# EAGLE design wt41_breakout_board_v22 (EAGLE 6.5.0)
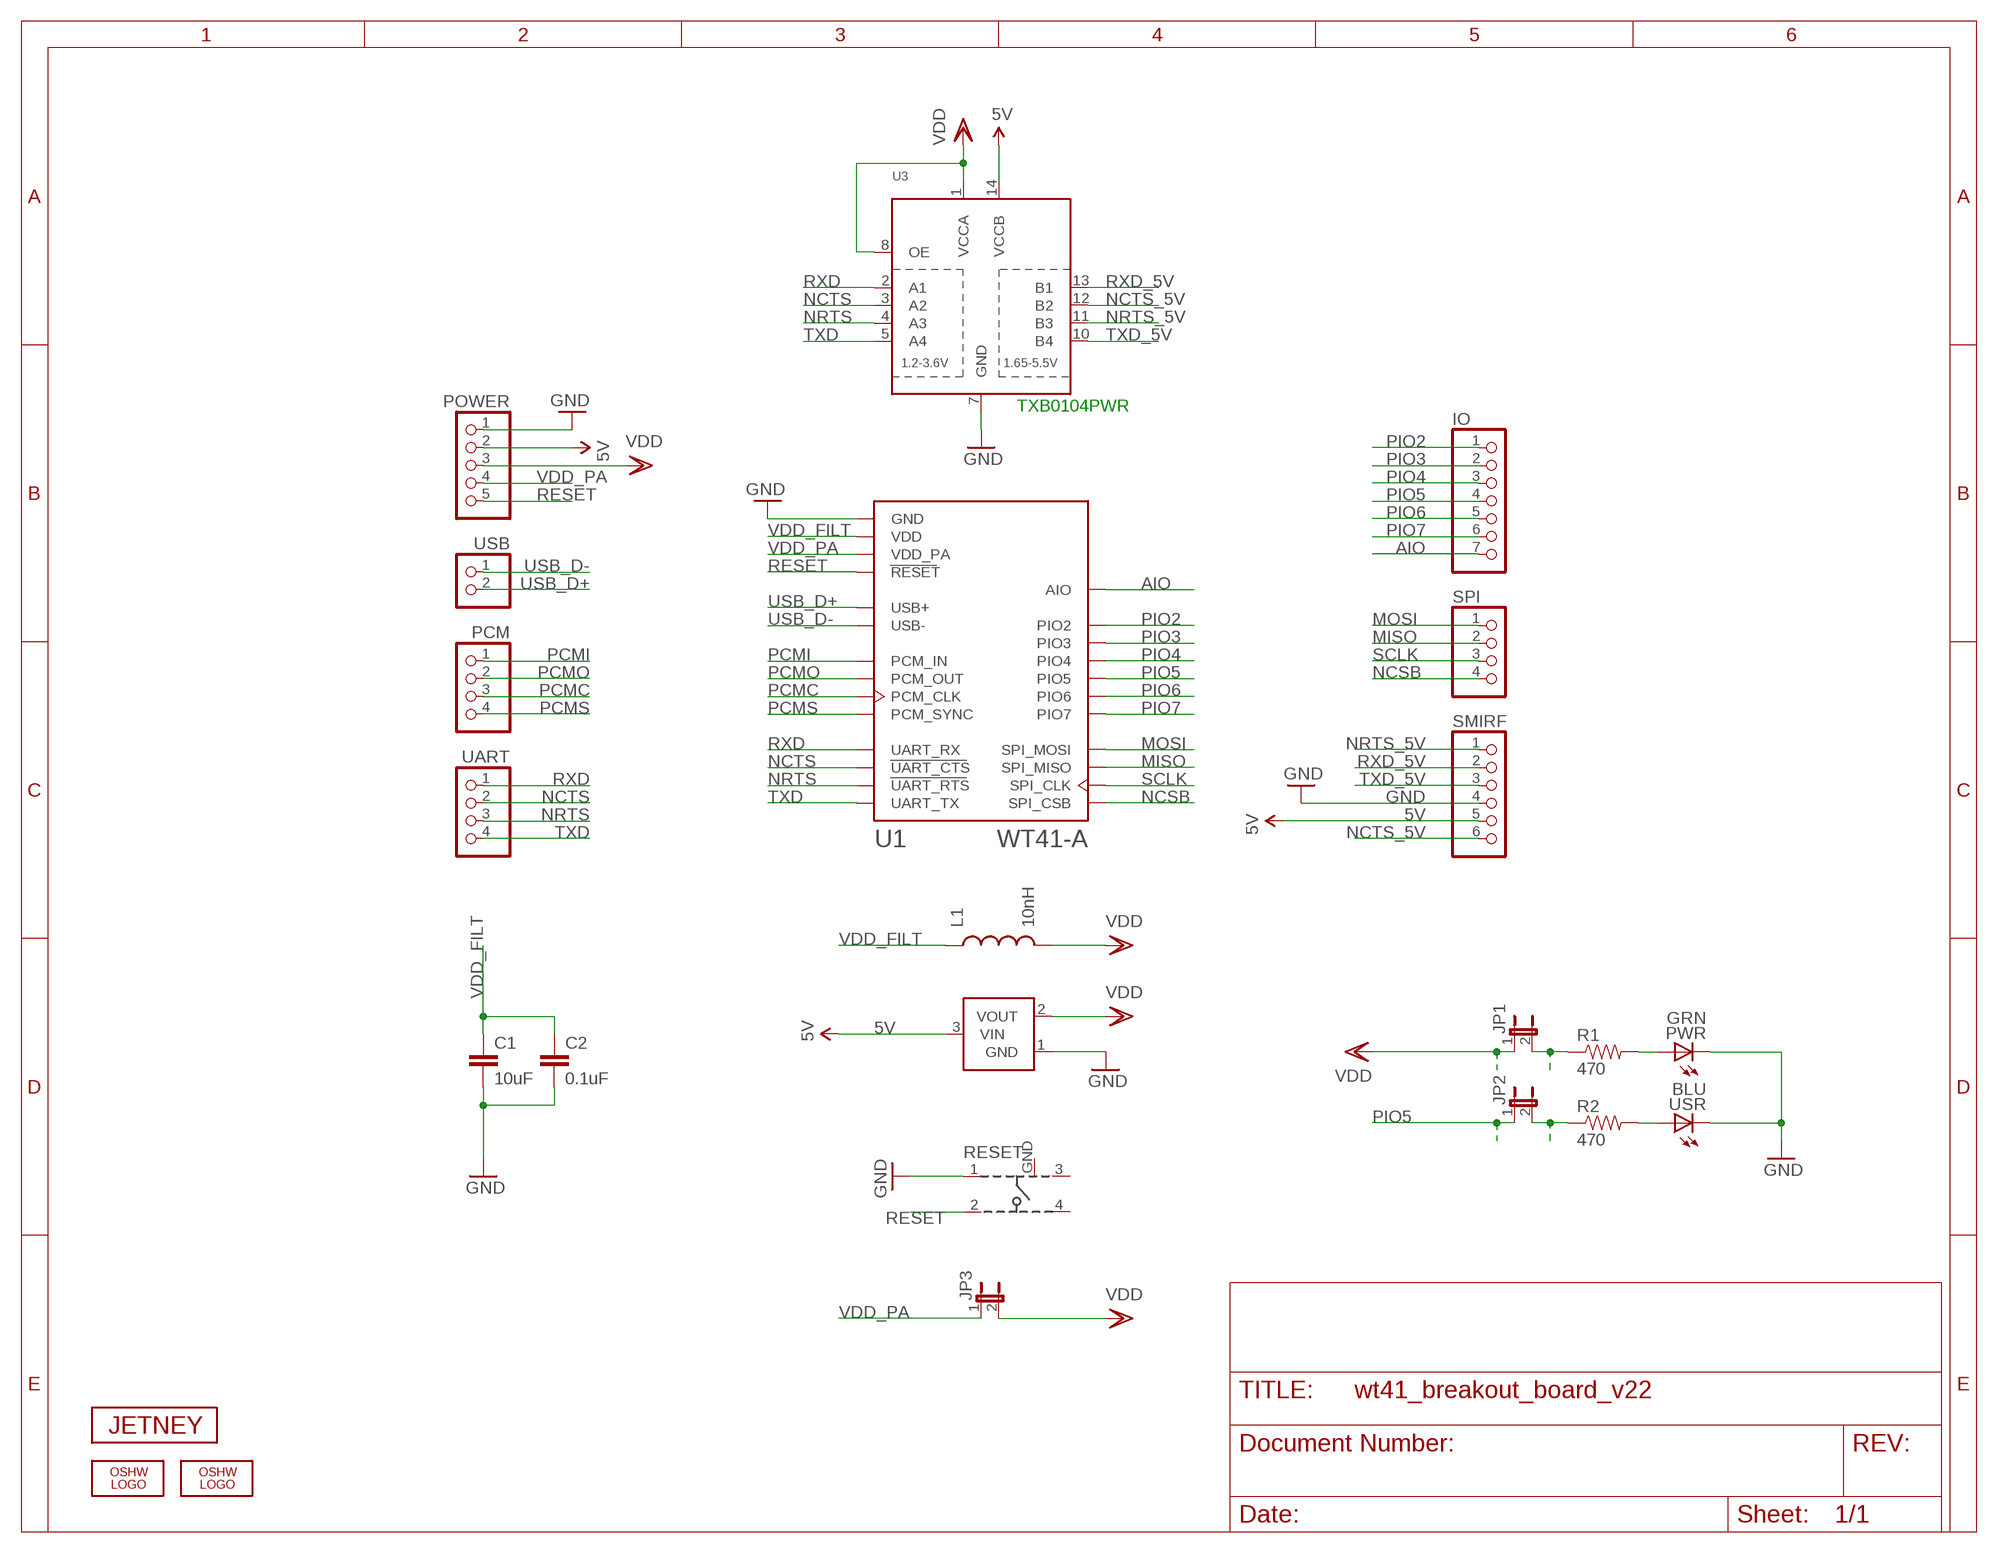
[diagram p0: schematic, sheet 1]

## Parts
C1  10uF  CAP0603-CAP  [0603-CAP]
C2  0.1uF  CAP0603-CAP  [0603-CAP]
IO  PINHD-1X7  [1X07]
JP1  JUMPER-2SMD-NC  [SJ_2S]
JP2  JUMPER-2SMD-NC  [SJ_2S]
JP3  JUMPER-2SMD-NC  [SJ_2S]
L1  10nH  INDUCTOR0603  [0603]
LOGO1  OSHW_LOGO_FILLX0070-NT  [OSHW_FILLX70_NOTEXT]
LOGO2  OSHW_LOGO_FILLX0070-NT  [OSHW_FILLX70_NOTEXT]
PCM  PINHD-1X4  [1X04]
POWER  PINHD-1X5  [1X05]
PWR  GRN  LEDCHIPLED_0805  [CHIPLED_0805]
R1  470  RESISTOR0603-RES  [0603-RES]
R2  470  RESISTOR0603-RES  [0603-RES]
RESET  101-IG  [101-IG]
SMIRF  PINHD-1X6  [1X06]
SPI  PINHD-1X4  [1X04]
U1  WT41-A  [WT41-A]
U2  MCP1700  [SOT23-3]
U3  TXB0104PWR  [TSSOP14]
U$2  JETNEY-LOGO-12  [JETNEY-LOGO-12]
UART  PINHD-1X4  [1X04]
USB  PINHD-1X2  [1X02]
USR  BLU  LEDCHIPLED_0805  [CHIPLED_0805]

## Nets
5V [power]: POWER.2 SMIRF.5 U2.3(VIN) U3.14(VCCB)
AIO: IO.7 U1.AIO
GND [power]: C1.2 C2.2 POWER.1 PWR.C RESET.1 SMIRF.4 U1.GND U1.GND@2(GND) U1.GND@3(GND) U1.GND@4(GND) U1.GND@5(GND) U1.GND@6(GND) U1.GND@7(GND) U1.GND@8(GND) U1.GND@9(GND) U1.GND@10(GND) U1.GND@11(GND) U1.GND@12(GND) U1.GND@13(GND) U1.GND@14(GND) U1.GND@15(GND) U1.GND@16(GND) U1.GND@17(GND) U1.GND@18(GND) U1.GND@19(GND) U1.GND@20(GND) U1.GND@21(GND) U1.GND@22(GND) U1.GND@23(GND) U1.GND@24(GND) U1.GND@25(GND) U1.GND@26(GND) U1.GND@27(GND) U1.GND@28(GND) U1.GND@29(GND) U1.GND@30(GND) U1.GND@31(GND) U2.1(GND) U3.7(GND) USR.C
MISO: SPI.2 U1.SPI_MISO
MOSI: SPI.1 U1.SPI_MOSI
N$1: PWR.A R1.2
N$3: R2.2 USR.A
N$4: JP2.2 R2.1
NCSB: SPI.4 U1.SPI_CSB
NCTS: U1.UART_CTS U3.3(A2) UART.2
NCTS_5V: SMIRF.6 U3.12(B2)
NRTS: U1.UART_RTS U3.4(A3) UART.3
NRTS_5V: SMIRF.1 U3.11(B3)
PCMC: PCM.3 U1.PCM_CLK
PCMI: PCM.1 U1.PCM_IN
PCMO: PCM.2 U1.PCM_OUT
PCMS: PCM.4 U1.PCM_SYNC
PIO2: IO.1 U1.PIO2
PIO3: IO.2 U1.PIO3
PIO4: IO.3 U1.PIO4
PIO5: IO.4 JP2.1 U1.PIO5
PIO6: IO.5 U1.PIO6
PIO7: IO.6 U1.PIO7
RESET: POWER.5 RESET.2 U1.RESET
RXD: U1.UART_RX U3.2(A1) UART.1
RXD_5V: SMIRF.2 U3.13(B1)
SCLK: SPI.3 U1.SPI_CLK
TXD: U1.UART_TX U3.5(A4) UART.4
TXD_5V: SMIRF.3 U3.10(B4)
USB_D+: U1.USB+ USB.2
USB_D-: U1.USB- USB.1
VDD [power]: JP1.1 JP3.2 L1.2 POWER.3 U2.2(VOUT) U3.1(VCCA) U3.8(OE)
VDD_FILT [power]: C1.1 C2.1 L1.1 U1.VDD
VDD_PA [power]: JP3.1 POWER.4 U1.VDD_PA
VDDJP1 [power]: JP1.2 R1.1
Unconnected: RESET.3 RESET.4

## Notes on the sheet
- TXB0104PWR

## Power pins joined to a net without a drawn wire
GND: RESET.GND

## Library data of the parts
C1 C2 = SparkFun:CAP: Capacitor Standard 0603 ceramic capacitor, and 0.1" leaded capacitor.
IO = sf-pinhead:PINHD-1X7: PIN HEADER
JP1-JP3 = SparkFun:JUMPER-2: Jumper Basic 0.1" spaced jumper. Use with breakaway headers.
L1 = SparkFun:INDUCTOR: Inductors Basic Inductor/Choke - 0603 and 1206. Footprints are not proven and vary greatly between part numbers.
LOGO1 LOGO2 = oshw-logo:OSHW_LOGO_FILL
PCM SPI UART = sf-pinhead:PINHD-1X4: PIN HEADER
POWER = sf-pinhead:PINHD-1X5: PIN HEADER
PWR USR = adafruit:LED: LED OSRAM: - CHIPLED LG R971, LG N971, LY N971, LG Q971, LY Q971, LO R971, LY R971 LH N974, LH R974 LS Q976, LO Q976, LY Q976 LO Q996 - Hyper CHIPLED LW Q18S LB Q993, LB Q99A, LB R99A - SideLED LS A670, LO A670, LY A670, LG A670, LP A670 LB A673, LV A673, LT A673, LW A673 LH A674 LY A675 LS A676, LA A676, LO A676, LY A676, LW A676 LS A679, LY A679, LG A679 - Hyper Micro SIDELED® LS Y876, LA Y876, LO Y876, LY Y876 LT Y87S - SmartLED LW L88C, LW L88S LB L89C, LB L89S, LG L890 LS L89K, LO L89K, LY L89K LS L896, LA L896, LO L896, LY L896 - TOPLED LS T670, LO T670, LY T670, LG T670, LP T670 LSG T670, LSP T670, LSY T670, LOP T670, LYG T670 LG T671, LOG T671, LSG T671 LB T673, LV T673, LT T673, LW T673 LH T674 LS T676, LA T676, LO T676, LY T676, LB T676, LH T676, LSB T676, LW T676 LB T67C, LV T67C, LT T67C, LS T67K, LO T67K, LY T67K, LW E67C LS E67B, LA E67B, LO E67B, LY E67B, LB E67C, LV E67C, LT E67C LW T67C LS T679, LY T679, LG T679 LS T770, LO T770, LY T770, LG T770, LP T770 LB T773, LV T773, LT T773, LW T773 LH T774 LS E675, LA E675, LY E675, LS T675 LS T776, LA T776, LO T776, LY T776, LB T776 LHGB T686 LT T68C, LB T68C - Hyper Mini TOPLED® LB M676 - Mini TOPLED Santana® LG M470 LS M47K, LO M47K, LY M47K Source: http://www.osram.convergy.de/
R1 R2 = SparkFun:RESISTOR: Resistor Basic schematic elements and footprints for 0603, 1206, and PTH resistors.
RESET = sf-keyglove:101-IG
SMIRF = sf-pinhead:PINHD-1X6: PIN HEADER
U1 = sf-bluegiga:WT41: Bluegiga WT41 long-range Bluetooth module - Bluetooth 2.1 + EDR (+20 dBm, 1000m). WT41-A variant has an on-module ceramic chip antenna, WT41-E variant has a U.Fl connector. WT41-A variant should be mounted over a solid ground plane. Antenna edge of the module should be flush up agains the edge of the PCB. See datasheet for variant layout details. The WT41 is a fully integrated Bluetooth 2.1 + EDR, class 1 module combining antenna, Bluetooth radio, and an on-board iWRAP Bluetooth stack. The WT41 provides a superior 110dB link budget and more than 1000-meter line-of-sight connectivity for Bluetooth applications where extreme radio performance or reliability is required. It also constitutes an ideal solution for developers that want to quickly integrate extremely high performing Bluetooth wireless technology into their design without investing several months in Bluetooth radio and stack development. The WT41 uses Bluegiga's iWRAP Bluetooth stack, which is an embedded Bluetooth stack implementing 13 different Bluetooth profiles and Apple iAP connectivity. By using WT41 combined with iWRAP Bluetooth stack and Bluegiga's excellent technical support, designers ensure quick time-to-market, and low development costs and risks. http://www.bluegiga.com/en-US/products/bluetooth-classic-modules/wt41-long-range-bluetooth--module https://github.com/jrowberg/sf-oshw Last updated 2014-01-04 by Jeff Rowberg <jeff@rowberg.net>; ANTENNA: On-module ceramic chip antenna
U2 = nonolith:MCP1700: Voltage regulator
U3 = SparkFun-DigitalIC:TXB0104PWR: 4-Bit Bi-Directional Level Shifter 1.2V-3.6V (VCCA) to 1.65V-5.5V (VCCB) bi-directional level shifter with auto direction sensing. Max data rate - VCCA 1.8V: 20Mbps (50ns), VCCA 3.3V: 100Mbps (10ns) Digikey: 296-21929-1-ND (TSSOP) IC-11329
U$2 = sf-keyglove:JETNEY-LOGO
USB = sf-pinhead:PINHD-1X2: PIN HEADER

## Net classes
0 default: width 0.152 mm, drill 0.33 mm, clearance 0.152 mm
1 power: width 0.254 mm, drill 0.33 mm, clearance 0.152 mm

## Board
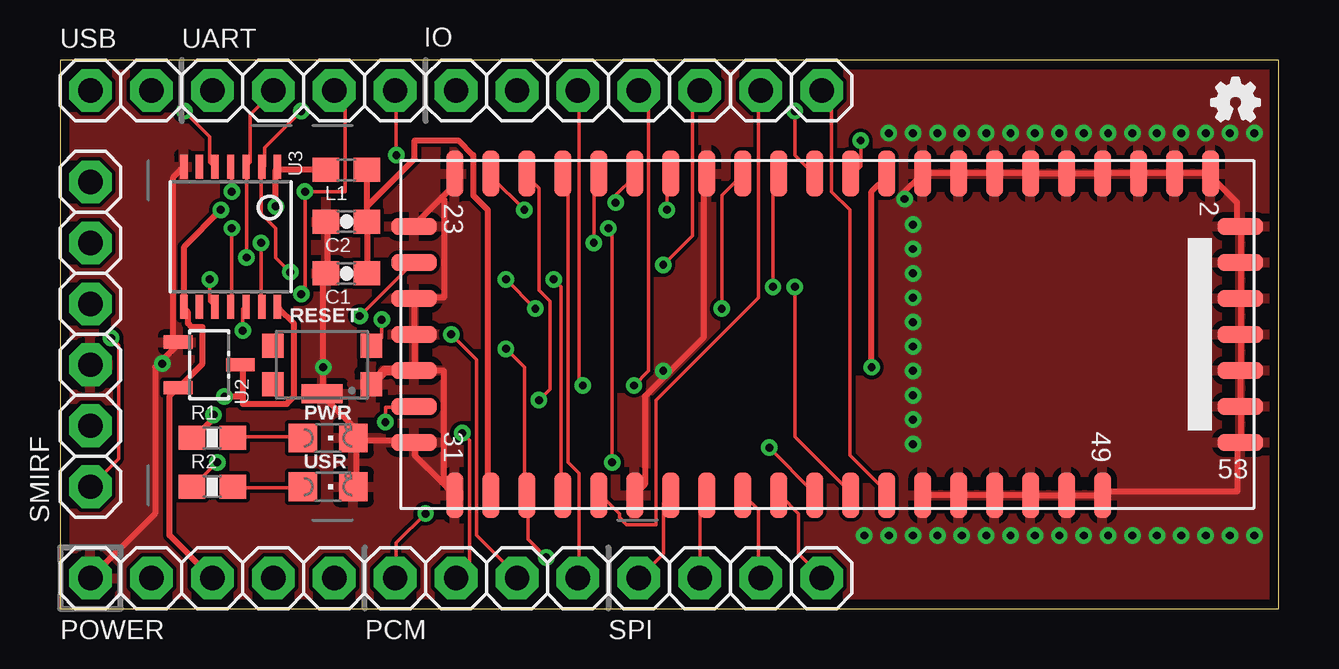
[diagram p1: board, top side]
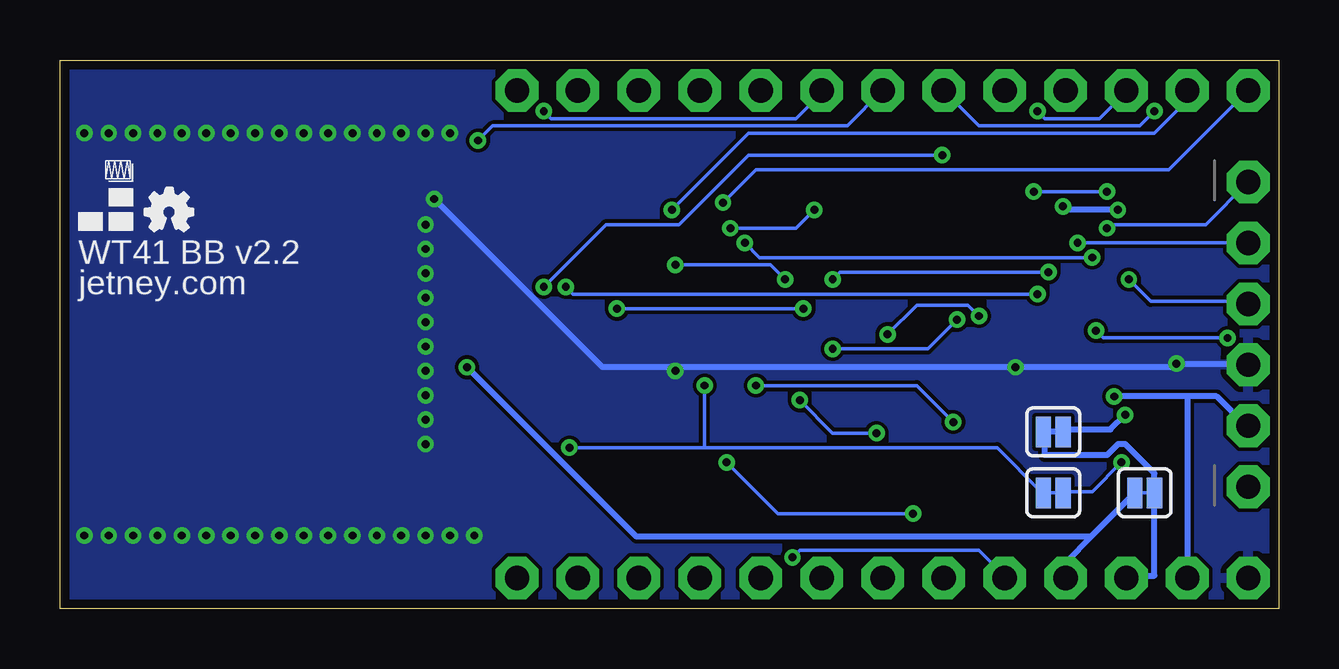
[diagram p2: board, bottom side, seen from below]

Size 50.8 x 22.86 mm. Coordinates in mm from the lower left corner, seen from the top.
Outline: 0,0 50.8,0 50.8,22.86 0,22.86 0,0
Copper layers (1*16): Top 0.0356mm / dielectric 1.5011mm / Bottom 0.0356mm
Design rules "LaenPCBOrder *": minimum track width 6mil, minimum drill 13mil, track to track 6mil, track to pad 6mil, pad to pad 6mil, via to via 6mil, smd to smd 6mil, copper to edge 15mil, drill to drill 6mil, minimum pad ring 7mil, minimum via ring 7mil, stop-mask expansion 4mil, vias tented up to drill 13mil, thermal gap 10mil
vRestrict: area 0,19.3 to 33,20.3; area 2.5,2.5 to 33,3.6; area 2.5,3.8 to 3.8,19.1; area 10.2,5.8 to 11.7,6.3; area 10.2,7.9 to 11.7,8.4

### Footprints (pad centres in the part's own frame; a part is rotated, then mirrored left to right if it is on the bottom)
0603-CAP = smd 1.1 x 1: 1 -0.85,0; 2 0.85,0
1X07 = drill 1.016 pad 1.778 octagon: 1 -7.62,0; 2 -5.08,0; 3 -2.54,0; 4 0,0; 5 2.54,0; 6 5.08,0; 7 7.62,0
SJ_2S = smd 0.635 x 1.27: 1 -0.412,0; 2 0.412,0
0603 = smd 1.1 x 1: 1 -0.85,0; 2 0.85,0
1X04 = drill 1.016 pad 1.778 octagon: 1 -3.81,0; 2 -1.27,0; 3 1.27,0; 4 3.81,0
1X05 = drill 1.016 pad 1.778 octagon: 1 -5.08,0; 2 -2.54,0; 3 0,0; 4 2.54,0; 5 5.08,0
CHIPLED_0805 = smd 1.2 x 1.2: A 0,-1.05; C 0,1.05
0603-RES = smd 1.1 x 1: 1 -0.85,0; 2 0.85,0
101-IG = smd 0.9 x 1: 1 -2.05,0.8; 2 -2.05,-0.8; 3 2.05,0.8; 4 2.05,-0.8 | smd 1.7 x 0.8: GND 0,1.2
1X06 = drill 1.016 pad 1.778 octagon: 1 -6.35,0; 2 -3.81,0; 3 -1.27,0; 4 1.27,0; 5 3.81,0; 6 6.35,0
WT41-A = smd 1.9 x 0.7: AIO 6.7,2.45; GND -6.7,15.95; GND@2 -6.7,14.45; GND@3 -6.7,12.95; GND@4 -6.7,11.45; GND@5 -6.7,9.95; GND@6 -6.7,8.45; GND@7 -6.7,6.95; GND@8 -6.7,5.45; GND@9 -6.7,3.95; GND@10 -6.7,-5.05; GND@11 -6.7,-15.55; GND@17 6.7,-15.55; GND@18 6.7,-8.05; GND@19 6.7,3.95; GND@20 6.7,5.45; GND@21 6.7,6.95; GND@22 6.7,8.45; GND@23 6.7,9.95; GND@24 6.7,11.45; PCM_CLK -6.7,-12.55; PCM_IN -6.7,-11.05; PCM_SYNC -6.7,-14.05; PIO2 -6.7,0.95; PIO3 -6.7,-0.55; PIO5 6.7,-0.55; PIO6 6.7,-11.05; PIO7 6.7,-9.55; RESET 6.7,-12.55; SPI_CLK 6.7,-5.05; SPI_CSB 6.7,-6.55; SPI_MISO 6.7,-3.55; SPI_MOSI 6.7,-2.05; UART_CTS -6.7,-9.55; UART_RTS -6.7,-2.05; UART_RX -6.7,-3.55; UART_TX 6.7,0.95; USB+ -6.7,-6.55; USB- -6.7,-8.05; VDD 6.7,-14.05; VDD_PA -6.7,2.45 | smd 0.7 x 1.9: GND@12 -4.5,-17.25; GND@13 -1.5,-17.25; GND@14 0,-17.25; GND@15 1.5,-17.25; GND@16 4.5,-17.25; GND@25 4.5,17.2; GND@26 3,17.2; GND@27 1.5,17.2; GND@28 0,17.2; GND@29 -1.5,17.2; GND@30 -3,17.2; GND@31 -4.5,17.2; PCM_OUT -3,-17.25; PIO4 3,-17.25
SOT23-3 = smd 0.55 x 1.2: 1 0.95,1.3; 2 -0.95,1.3; 3 0,-1.3
TSSOP14 = smd 0.305 x 0.991: 1 -1.95,-2.918; 2 -1.3,-2.918; 3 -0.65,-2.918; 4 0,-2.918; 5 0.65,-2.918; 6 1.3,-2.918; 7 1.95,-2.918; 8 1.95,2.918; 9 1.3,2.918; 10 0.65,2.918; 11 0,2.918; 12 -0.65,2.918; 13 -1.3,2.918; 14 -1.95,2.918
1X02 = drill 1.016 pad 1.778 octagon: 1 -1.27,0; 2 1.27,0

### Placement (x,y rotation side)
C1  11.94,13.97 180 top
C2  11.94,16.13 180 top
IO  24.13,21.59 0 top
JP1  9.4,7.37 0 bottom
JP2  9.4,4.83 0 bottom
JP3  5.59,4.83 0 bottom
L1  11.94,18.29 180 top
LOGO1  48.01,20.32 0 top
LOGO2  47.24,15.75 0 bottom
PCM  17.78,1.27 180 top
POWER  6.35,1.27 0 top
PWR  11.18,7.11 270 top
R1  6.35,7.11 0 top
R2  6.35,5.08 0 top
RESET  10.92,10.16 180 top
SMIRF  1.27,11.43 270 top
SPI  27.94,1.27 180 top
U1  32,11.43 270 top
U2  6.22,10.16 90 top
U3  7.11,15.49 180 top
U$2  50.04,15.75 0 bottom
UART  10.16,21.59 0 top
USB  2.54,21.59 0 top
USR  11.18,5.08 270 top

### Tracks (layer width: path | path; a pad name or v marks a point on that pad's centre or on a via)
5V  (via drill 0.33)
  Top 0.254: 7.62,8.84 7.62,10.06 U2.3 | 7.62,8.84 7.62,8.53 9.45,8.53 9.75,8.84 9.75,11.89 9.14,12.5 U3.14 | v6.86,8.84 7.62,8.84
  Bottom 0.254: 3.81,8.84 2.59,8.84 1.37,7.62 SMIRF.5 | 3.81,8.84 v6.86,8.84 | 3.81,8.84 POWER.2
AIO
  Top 0.152: IO.7 32.16,21.18 32.16,17.37 32.92,16.61 32.92,6.4 34.44,4.88 U1.AIO
GND  (via drill 0.33)
  Top 0.254: U1.GND 47.85,18.14 46.48,18.14 U1.GND@2 46.33,18.14 U1.GND@3 44.81,18.14 43.59,18.14 U1.GND@4 43.43,18.14 42.06,18.14 U1.GND@5 41.91,18.14 40.54,18.14 U1.GND@6 40.39,18.14 39.01,18.14 U1.GND@7 38.86,18.14 37.49,18.14 U1.GND@8 37.34,18.14 35.97,18.14 U1.GND@9 35.81,17.98 35.2,17.37 v35.2,17.07 | 48.01,18.14 U1.GND | U1.GND@19 35.97,4.72 37.34,4.72 U1.GND@20 37.49,4.72 38.86,4.72 U1.GND@21 39.01,4.72 40.39,4.72 U1.GND@22 40.54,4.72 41.91,4.72 U1.GND@23 42.06,4.72 43.43,4.72 U1.GND@24 43.59,4.88 49.07,4.88 49.07,6.86 U1.GND@25 49.23,7.01 49.23,8.38 U1.GND@26 49.23,8.53 49.23,9.91 U1.GND@27 49.23,10.06 49.23,11.43 | 49.23,11.43 49.23,12.8 U1.GND@29 49.23,12.95 49.23,14.33 U1.GND@30 49.23,14.48 49.23,15.85 U1.GND@31 | 49.23,16 U1.GND@31 | 49.23,11.43 U1.GND@28 | U1.GND 48.01,17.98 49.07,16.92 49.07,16 U1.GND@31 | 14.78,11.43 14.78,10.06 U1.GND@15 14.78,9.91 16,9.91 16,5.33 15.93,5.26 | 14.78,11.43 14.78,12.8 U1.GND@13 14.78,12.95 16,12.95 16,17.07 15.93,17.14 | 14.78,11.43 U1.GND@14 | 15.93,17.14 16.31,17.53 16.31,17.98 U1.GND@11 | 15.93,17.14 14.78,16 U1.GND@12 | U1.GND@17 16.31,4.88 15.93,5.26 | 15.93,5.26 14.78,6.4 14.78,6.86 U1.GND@16 | 14.78,7.01 U1.GND@16 | C2.2 11.12,16 11.12,14.02 C1.2 10.97,13.87 v10.97,10.06 10.97,8.99 RESET.GND 10.97,8.84 12.19,7.62 12.19,7.16 PWR.C 12.34,7.01 | 12.34,7.01 12.34,5.18 USR.C | 12.34,7.01 14.63,7.01 U1.GND@16 | 23.93,4.72 U1.GND@18 24.08,4.88 24.38,5.18 24.38,8.84 25.38,9.83 | 25.38,9.83 26.82,11.28 26.82,17.98 U1.GND@10 26.98,18.14 | U3.7 5.03,18.29 4.72,17.98 4.72,11.28 4.88,11.12 U2.1 | 5.03,11.12 U2.1
  Top 0.254: POWER.1 3.96,3.96 3.96,10.06 4.19,10.29 | 4.19,10.29 4.88,10.97 U2.1 | v4.27,10.21 4.19,10.29 | v25.15,9.91 25.3,9.91 25.38,9.83
  Top 0.406: RESET.1 13.54,9.93 U1.GND@15
  Bottom 0.254: SMIRF.4 1.37,10.21 v4.27,10.21 4.42,10.06 v10.97,10.06 24.99,10.06 v25.15,9.91 25.15,10.06 28.19,10.06 v35.2,17.07
  other vias: 49.78,3.05 48.77,3.05 47.75,3.05 46.74,3.05 45.72,3.05 44.7,3.05 43.69,3.05 42.67,3.05 41.66,3.05 40.64,3.05 39.62,3.05 38.61,3.05 37.59,3.05 36.58,3.05 35.56,3.05 34.54,3.05 33.53,3.05 49.78,19.81 48.77,19.81 47.75,19.81 46.74,19.81 45.72,19.81 44.7,19.81 43.69,19.81 42.67,19.81 41.66,19.81 40.64,19.81 39.62,19.81 38.61,19.81 37.59,19.81 36.58,19.81 35.56,19.81 34.54,19.81 35.56,16 35.56,14.99 35.56,13.97 35.56,12.95 35.56,11.94 35.56,10.92 35.56,9.91 35.56,8.89 35.56,7.87 35.56,6.86
  pour Top: 0,22.86 50.8,22.86 50.8,0 0,0
  pour Bottom: 0,22.86 50.8,22.86 50.8,0 0,0
MISO
  Top 0.152: U1.SPI_MISO 28.5,4.72 29.11,4.12 29.11,1.37 SPI.2
MOSI
  Top 0.152: U1.SPI_MOSI 30.02,4.72 30.79,3.96 30.79,2.29 31.7,1.37 SPI.1
N$1
  Top 0.152: R1.2 7.32,7.16 10.06,7.16 PWR.A
N$2
  Bottom 0.152: 5.33,4.83 5.84,4.83
N$3
  Top 0.152: R2.2 7.32,5.03 10.06,5.03 USR.A
N$4  (via drill 0.33)
  Top 0.152: v6.55,6.1 5.64,5.18 R2.1
  Bottom 0.152: v6.55,6.1 7.77,4.88 8.84,4.88 JP2.2
N$5
  Bottom 0.152: 9.14,4.83 9.65,4.83
N$6
  Bottom 0.254: 9.14,7.37 9.65,7.37
NCSB
  Top 0.152: SPI.4 25.15,2.29 25.15,4.42 U1.SPI_CSB
NCTS  (via drill 0.33)
  Top 0.152: UART.2 8.84,21.49 7.92,20.57 7.92,18.59 7.77,18.44 U3.3 7.77,18.29 v7.77,14.63 | v22.25,15.24 22.25,17.83 22.4,17.98 U1.UART_CTS
  Bottom 0.152: v22.25,15.24 21.64,14.63 v7.77,14.63
NCTS_5V  (via drill 0.33)
  Top 0.152: v7.62,11.58 7.62,12.5 U3.12 | v2.13,11.28 2.44,10.97 2.44,6.25 SMIRF.6
  Bottom 0.152: v7.62,11.58 7.32,11.28 v2.13,11.28
NRTS  (via drill 0.33)
  Top 0.152: v7.16,17.37 7.16,18.29 U3.4 | UART.3 11.43,21.49 11.89,21.03 11.89,17.37 v10.21,17.37 10.21,13.26 v10.06,13.11 | v29.72,13.41 29.72,17.83 29.87,17.98 U1.UART_RTS
  Bottom 0.152: v10.21,17.37 v7.16,17.37 | v29.72,13.41 29.41,13.11 v10.06,13.11
NRTS_5V  (via drill 0.33)
  Top 0.152: v7.16,15.85 7.16,12.65 U3.11
  Bottom 0.152: v7.16,15.85 7.01,16 3.05,16 SMIRF.1
PCMC  (via drill 0.33)
  Top 0.152: v19.96,8.69 20.42,9.14 20.42,12.8 19.96,13.26 19.96,17.53 19.51,17.98 U1.PCM_CLK | v16.76,7.32 17.07,7.01 17.07,1.83 PCM.3
  Bottom 0.152: v19.96,8.69 18.59,7.32 v16.76,7.32
PCMI
  Top 0.152: U1.PCM_IN 21.03,17.98 21.18,17.83 21.18,6.1 21.64,5.64 21.64,1.37 PCM.1
PCMO  (via drill 0.33)
  Top 0.152: v12.5,12.19 14.63,14.33 U1.PCM_OUT | v16.31,11.43 17.37,10.36 17.37,3.05 19.05,1.37 PCM.2
  Bottom 0.152: v12.5,12.19 12.95,12.65 15.09,12.65 v16.31,11.43
PCMS  (via drill 0.33)
  Top 0.152: v19.36,16.61 17.98,17.98 U1.PCM_SYNC | v22.86,15.85 23.01,15.7 v23.01,6.1 | v15.24,3.96 14.02,2.74 14.02,1.37 PCM.4
  Bottom 0.152: v19.36,16.61 20.12,15.85 v22.86,15.85 | v23.01,6.1 20.88,3.96 v15.24,3.96
PIO2  (via drill 0.33)
  Top 0.152: v33.38,19.51 33.38,18.44 33.07,18.14 U1.PIO2
  Bottom 0.152: v33.38,19.51 32.77,20.12 17.98,20.12 IO.1
PIO3  (via drill 0.33)
  Top 0.152: v30.63,20.73 30.63,18.9 31.39,18.14 U1.PIO3
  Bottom 0.152: v30.63,20.73 30.33,20.42 20.12,20.42 19.05,21.49 IO.2
PIO4  (via drill 0.33)
  Top 0.152: v13.56,7.77 13.56,8.38 14.63,8.38 U1.PIO4 | v21.79,9.3 21.64,9.45 21.64,21.49 IO.3
  Bottom 0.152: v13.56,7.77 15.09,9.3 v21.79,9.3
PIO5  (via drill 0.33)
  Top 0.152: v29.57,6.71 31.39,4.88 U1.PIO5 | IO.4 24.54,21.18 24.54,9.91 v23.93,9.3
  Bottom 0.152: v29.57,6.71 23.93,6.71 | 23.93,6.71 11.73,6.71 9.91,4.88 JP2.1 | 23.93,6.71 v23.93,9.3
PIO6  (via drill 0.33)
  Top 0.152: v20.57,13.72 20.88,13.41 20.88,4.88 U1.PIO6 | v25.15,14.33 26.36,15.54 26.36,21.18 26.67,21.49 IO.5
  Bottom 0.152: v20.57,13.72 21.18,14.33 v25.15,14.33
PIO7
  Top 0.152: U1.PIO7 22.55,4.72 23.32,3.96 23.32,3.81 23.62,3.5 24.84,3.5 24.84,8.69 29.11,12.95 29.11,21.49 IO.6
RESET  (via drill 0.33)
  Top 0.152: v13.41,12.04 13.41,11.28 13.11,10.97 RESET.2 | v18.59,10.82 19.36,10.06 19.36,4.88 U1.RESET 19.51,4.72 19.51,2.9 v20.27,2.13
  Bottom 0.152: v13.41,12.04 14.63,10.82 v18.59,10.82 | v20.27,2.13 19.96,2.44 12.5,2.44 11.43,1.37 POWER.5
RXD  (via drill 0.33)
  Top 0.152: v10.06,20.73 8.53,19.2 8.53,18.44 U3.2 8.38,18.29 8.38,16.46 8.99,15.85 8.99,14.63 v9.6,14.02 | v27.58,12.5 27.58,17.22 28.35,17.98 U1.UART_RX | v18.59,13.72 v19.81,12.5
  Bottom 0.152: v10.06,20.73 9.75,20.42 7.47,20.42 6.4,21.49 UART.1 | v19.81,12.5 v27.58,12.5 | v18.59,13.72 18.29,14.02 v9.6,14.02
RXD_5V  (via drill 0.33)
  Top 0.152: v8.38,15.24 8.38,12.65 U3.13
  Bottom 0.152: SMIRF.2 v8.38,15.24
SCLK
  Top 0.152: SPI.3 26.67,4.57 26.82,4.72 U1.SPI_CLK
TXD  (via drill 0.33)
  Top 0.152: v5.18,20.73 6.25,19.66 6.25,18.59 6.4,18.44 U3.5 | v30.63,13.41 30.63,7.16 32.92,4.88 U1.UART_TX | v14.02,18.9 14.02,21.49 UART.4
  Bottom 0.152: v5.18,20.73 5.79,20.12 12.5,20.12 UART.4 | v30.63,13.41 28.04,16 24.99,16 22.1,18.9 v14.02,18.9
TXD_5V  (via drill 0.33)
  Top 0.152: v6.25,13.72 6.25,12.8 6.4,12.65 U3.10
  Bottom 0.152: v6.25,13.72 5.33,12.8 1.37,12.8 SMIRF.3
USB_D+  (via drill 0.33)
  Top 0.152: v25.3,16.61 25.3,17.83 25.45,17.98 U1.USB+
  Bottom 0.152: v25.3,16.61 22.1,19.81 5.18,19.81 3.81,21.18 USB.2
USB_D-  (via drill 0.33)
  Top 0.152: v23.16,16.92 23.16,17.22 23.93,17.98 U1.USB-
  Bottom 0.152: v23.16,16.92 21.79,18.29 4.57,18.29 USB.1
VDD  (via drill 0.33)
  Top 0.254: L1.2 9.14,18.29 U3.1 8.99,18.29 v8.99,16.76 | v6.71,16.61 5.18,15.09 5.18,12.65 U3.8 5.18,12.5 5.33,12.34 5.33,11.89 5.49,11.73 5.94,11.73 5.94,10.21 5.03,9.3 U2.2 4.88,9.14 4.57,8.84 4.57,3.05 POWER.3
  Bottom 0.254: v8.99,16.76 8.84,16.61 v6.71,16.61 | 9.91,7.47 JP1.1 9.75,7.32 9.75,6.4 7.16,6.4 6.71,6.86 6.4,6.86 5.18,5.64 5.18,4.88 JP3.2 5.18,4.72 5.18,1.37 6.25,1.37 POWER.3
VDD_FILT
  Top 0.254: C1.1 12.8,14.02 12.8,16 C2.1 12.8,16.15 12.8,16.76 | 12.8,16.76 12.8,18.29 L1.1 | 12.8,16.76 14.78,18.75 14.78,19.51 16.61,19.51 17.22,18.9 17.22,17.22 17.83,16.61 17.83,4.88 U1.VDD
VDD_PA  (via drill 0.33)
  Top 0.254: U1.VDD_PA 34.44,17.98 33.83,17.37 v33.83,10.06
  Bottom 0.254: 7.82,3 8.84,1.98 8.84,1.37 POWER.4 | 7.82,3 6.1,4.72 JP3.1 | v33.83,10.06 26.77,3 7.82,3
VDDJP1  (via drill 0.33)
  Top 0.254: v6.4,8.08 6.4,7.92 5.64,7.16 R1.1
  Bottom 0.254: v6.4,8.08 7.01,7.47 8.84,7.47 JP1.2

### Text on the board
bPlace: WT41 BB v2.2 | jetney.com
tDocu: D- D+ | RTS RXD TXD GND VCC CTS | RXD CTS RTS TXD | P2 P3 P4 P5 P6 P7 | AIO | Bluegiga / WT41-A | GND 3V3 VPA RES SYN CLK OUT CSB SCK | 5V | IN | MISO | MOSI
bDocu: RTS RXD TXD GND VCC CTS | PWR | VDDPA | PIO5